# EAGLE schematic adapter (EAGLE 7.2.0)
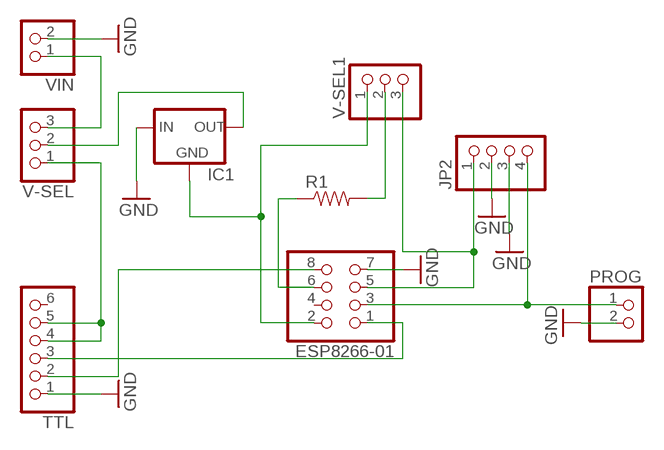
[diagram p0: schematic, sheet 1]

## Parts
ESP8266-01  PINHD-2X4  [2X04]
IC1  V_REG_78XXSIDE  [78XXL]
JP2  PINHD-1X4  [1X04]
PROG  PINHD-1X2  [1X02]
R1  RESISTORAXIAL-0.3  [AXIAL-0.3]
TTL  PINHD-1X6  [1X06]
V-SEL  PINHD-1X3  [1X03]
V-SEL1  PINHD-1X3  [1X03]
VIN  PINHD-1X2  [1X02]

## Nets
GND: ESP8266-01.7 IC1.IN JP2.2 JP2.3 PROG.2 TTL.1 VIN.2
N$1: ESP8266-01.2 IC1.GND V-SEL1.1
N$2: ESP8266-01.8 TTL.2
N$3: ESP8266-01.1 TTL.3
N$4: ESP8266-01.3 JP2.4 PROG.1
N$5: TTL.4 TTL.5 V-SEL.1
N$7: V-SEL.3 VIN.1
N$8: ESP8266-01.6 R1.P$1
N$9: ESP8266-01.5 JP2.1 V-SEL1.3
N$10: R1.P$2 V-SEL1.2
N$11: IC1.OUT V-SEL.2
Unconnected: ESP8266-01.4 TTL.6

## Library data of the parts
ESP8266-01 = pinhead:PINHD-2X4: PIN HEADER
IC1 = SparkFun-PowerIC:V_REG_78XX: Voltage Regulator Standard 7805 5V regulator. IGO (Input Ground Output). Spark Fun Electronics SKU : COM-00107
JP2 = pinhead:PINHD-1X4: PIN HEADER
PROG VIN = pinhead:PINHD-1X2: PIN HEADER
R1 = SparkFun-Resistors:RESISTOR: Resistor Basic schematic elements and footprints for 0603, 1206, and PTH resistors.
TTL = pinhead:PINHD-1X6: PIN HEADER
V-SEL V-SEL1 = pinhead:PINHD-1X3: PIN HEADER